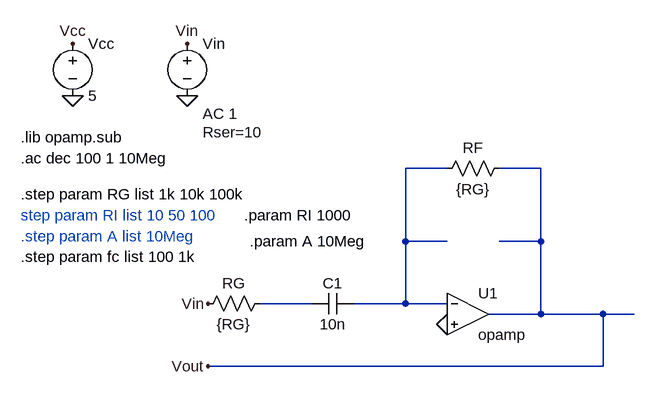
[diagram p0: schematic ABB_improved.asc]
ABB_improved.asc, the LTspice schematic file:
Version 4
SHEET 1 880 680
WIRE 560 240 496 240
WIRE 704 240 640 240
WIRE 496 352 496 240
WIRE 560 352 496 352
WIRE 704 352 704 240
WIRE 704 352 640 352
WIRE 352 448 272 448
WIRE 496 448 496 352
WIRE 496 448 416 448
WIRE 560 448 496 448
WIRE 704 464 704 352
WIRE 704 464 624 464
WIRE 800 464 704 464
WIRE 848 464 800 464
WIRE 800 544 800 464
WIRE 800 544 192 544
FLAG -16 128 0
FLAG -16 48 Vcc
FLAG 160 128 0
FLAG 160 48 Vin
FLAG 560 480 0
FLAG 192 448 Vin
FLAG 192 544 Vout
SYMBOL voltage -16 32 R0
SYMATTR InstName Vcc
SYMATTR Value 5
SYMBOL voltage 160 32 R0
WINDOW 123 24 124 Left 2
WINDOW 39 24 152 Left 2
SYMATTR InstName Vin
SYMATTR Value ""
SYMATTR Value2 AC 1
SYMATTR SpiceLine Rser=10
SYMBOL res 288 432 R90
WINDOW 0 0 56 VBottom 2
WINDOW 3 32 56 VTop 2
SYMATTR InstName RG
SYMATTR Value {RG}
SYMBOL res 656 224 R90
WINDOW 0 0 56 VBottom 2
WINDOW 3 32 56 VTop 2
SYMATTR InstName RF
SYMATTR Value {RG}
SYMBOL cap 416 432 R90
WINDOW 0 0 32 VBottom 2
WINDOW 3 32 32 VTop 2
SYMATTR InstName C1
SYMATTR Value 10n
SYMATTR SpiceLine Rser=0
SYMBOL OpAmps\\opamp 592 400 R0
SYMATTR InstName U1
SYMATTR SpiceLine Aol=A
SYMATTR SpiceLine2 GBW=A*fc
TEXT -96 192 Left 2 !.lib opamp.sub
TEXT -96 224 Left 2 !.ac dec 100 1 10Meg
TEXT -96 280 Left 2 !.step param RG list 1k 10k 100k
TEXT -96 312 Left 2 ;step param RI list 10 50 100
TEXT -96 344 Left 2 ;.step param A list 10Meg
TEXT -96 376 Left 2 !.step param fc list 100 1k
TEXT 248 312 Left 2 !.param RI 1000
TEXT 256 352 Left 2 !.param A 10Meg

The netlist it stands for:
* ABB_improved.asc
Vcc Vcc 0 5
Vin Vin 0 AC 1 Rser=10
RG N002 Vin {RG}
RF Vout N001 {RG}
C1 N001 N002 10n Rser=0
XU1 N001 0 Vout opamp Aol=A GBW=A*fc  ; pins invin noninvin out
.lib opamp.sub
.ac dec 100 1 10Meg
.step param RG list 1k 10k 100k
* step param RI list 10 50 100
* .step param A list 10Meg
.step param fc list 100 1k
.param RI 1000
.param A 10Meg
.backanno
.end